# Altium schematic sheet SLO.SchDoc
size B; DrawnBy: PWS; Engineer: PWS; DocumentNumber: 6; Revision: 1; SheetNumber: 6; SheetTotal: 7
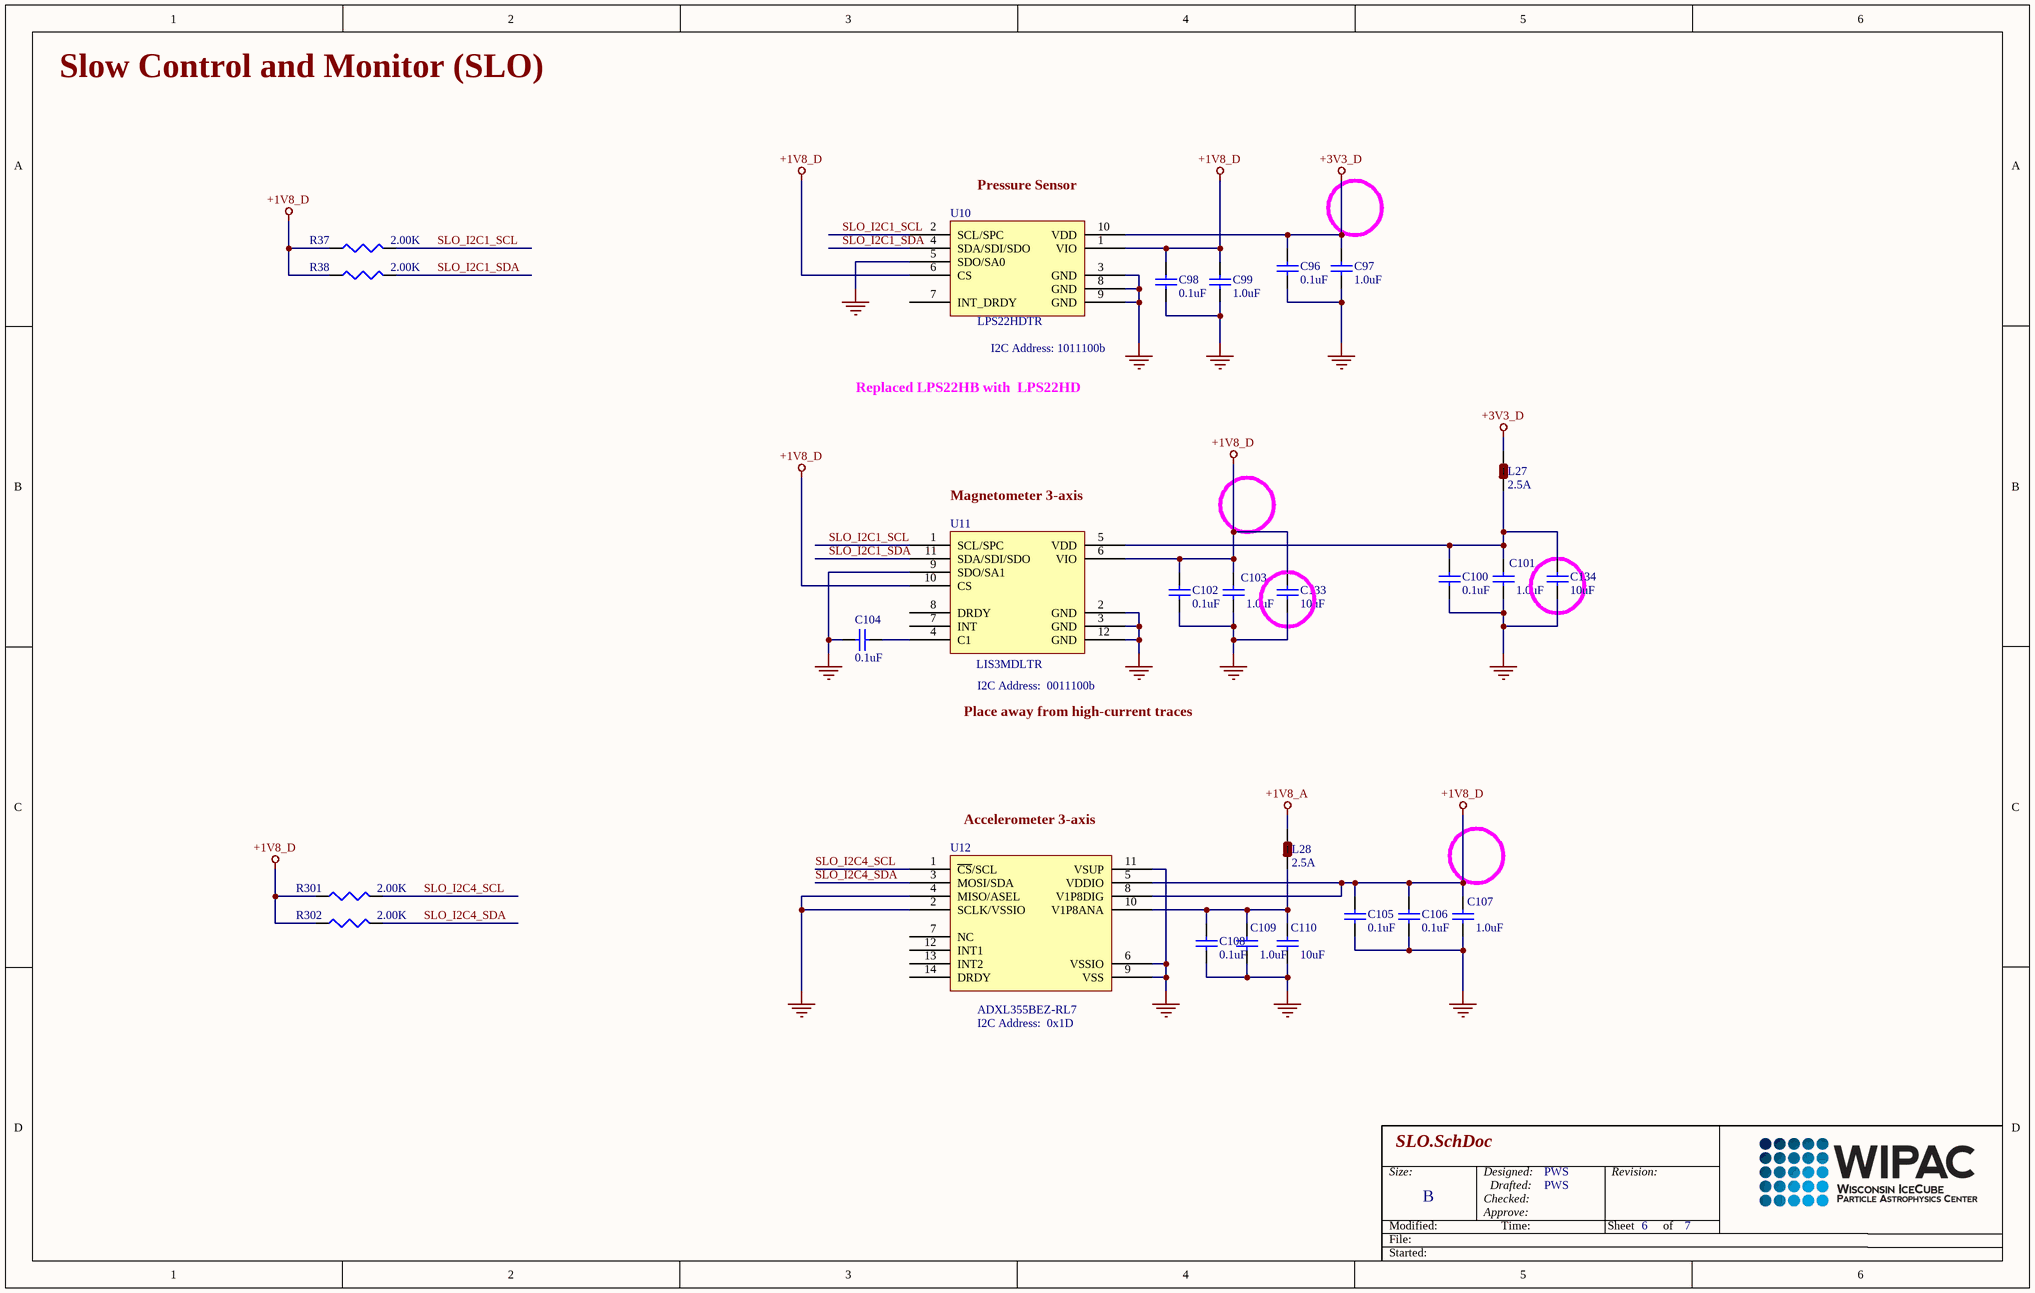
[diagram p0: SLO.SchDoc]

## Parts
C96  Capacitance: 0.1uF  [CAPC_0603]  (hidden comment: 0.1uF_603_50V)
C97  Capacitance: 1.0uF  [CAPC_0603]  (hidden comment: 1.0uF_603_25V)
C98  Capacitance: 0.1uF  [CAPC_0603]  (hidden comment: 0.1uF_603_50V)
C99  Capacitance: 1.0uF  [CAPC_0603]  (hidden comment: 1.0uF_603_25V)
C100  Capacitance: 0.1uF  [CAPC_0603]  (hidden comment: 0.1uF_603_50V)
C101  Capacitance: 1.0uF  [CAPC_0603]  (hidden comment: 1.0uF_603_25V)
C102  Capacitance: 0.1uF  [CAPC_0603]  (hidden comment: 0.1uF_603_50V)
C103  Capacitance: 1.0uF  [CAPC_0603]  (hidden comment: 1.0uF_603_25V)
C104  Capacitance: 0.1uF  [CAPC_0603]  (hidden comment: 0.1uF_603_50V)
C105  Capacitance: 0.1uF  [CAPC_0603]  (hidden comment: 0.1uF_603_50V)
C106  Capacitance: 0.1uF  [CAPC_0603]  (hidden comment: 0.1uF_603_50V)
C107  Capacitance: 1.0uF  [CAPC_0603]  (hidden comment: 1.0uF_603_25V)
C108  Capacitance: 0.1uF  [CAPC_0603]  (hidden comment: 0.1uF_603_50V)
C109  Capacitance: 1.0uF  [CAPC_0603]  (hidden comment: 1.0uF_603_25V)
C110  Capacitance: 10uF  [CAPC_0805]  (hidden comment: 10uF_805_10V)
C133  Capacitance: 10uF  [CAPC_0805]  (hidden comment: 10uF_805_10V)
C134  Capacitance: 10uF  [CAPC_0805]  (hidden comment: 10uF_805_10V)
L27  Max Current Rating: 2.5A  [SMD-0805]  (hidden comment: 2.5A_Bead_0805)
L28  Max Current Rating: 2.5A  [SMD-0805]  (hidden comment: 2.5A_Bead_0805)
R37  Resistance: 2.00K  [RES_0603]  (hidden comment: R_2.00K_603_1%)
R38  Resistance: 2.00K  [RES_0603]  (hidden comment: R_2.00K_603_1%)
R301  Resistance: 2.00K  [RES_0603]  (hidden comment: R_2.00K_603_1%)
R302  Resistance: 2.00K  [RES_0603]  (hidden comment: R_2.00K_603_1%)
U10  LPS22HDTR  [HLGA-10L]
U11  LIS3MDLTR  [VFLGA-12]
U12  ADXL355BEZ-RL7  [E-14-1]

## Nets
+1V8_A: L28.2
+1V8_D: C98.2 C99.2 C102.2 C103.2 C105.2 C106.2 C107.2 C133.2 R37.1 R38.1 R301.1 R302.1 U10.1(VIO) U10.6(CS) U11.6(VIO) U11.10(CS) U12.5(VDDIO) U12.8(V1P8DIG)
+3V3_D: C96.2 C97.2 L27.2 U10.10(VDD)
GND: C96.1 C97.1 C98.1 C99.1 C100.1 C101.1 C102.1 C103.1 C104.2 C105.1 C106.1 C107.1 C108.1 C109.1 C110.1 C133.1 C134.1 U10.3(GND) U10.5(SDO/SA0) U10.8(GND) U10.9(GND) U11.2(GND) U11.3(GND) U11.9(SDO/SA1) U11.12(GND) U12.2(SCLK/VSSIO) U12.4(MISO/ASEL) U12.6(VSSIO) U12.9(VSS) U12.11(VSUP)
SLO_I2C1_SCL: R37.2 U10.2(SCL/SPC) U11.1(SCL/SPC)
SLO_I2C1_SDA: R38.2 U10.4(SDA/SDI/SDO) U11.11(SDA/SDI/SDO)
SLO_I2C4_SCL: R301.2 U12.1(~{CS}/SCL)
SLO_I2C4_SDA: R302.2 U12.3(MOSI/SDA)
NetC100_2: C100.2 C101.2 C134.2 L27.1 U11.5(VDD)
NetC104_1: C104.1 U11.4(C1)
NetC108_2: C108.2 C109.2 C110.2 L28.1 U12.10(V1P8ANA)

Not connected (* = marked no-connect by the designer): U10 7(INT_DRDY); U11 7(INT) 8(DRDY); U12 7(NC) 12(INT1) 13(INT2) 14(DRDY)

## Notes on the sheet
- Slow Control and Monitor (SLO)
- (near U10) Pressure Sensor
- (near U10) I2C Address: 1011100b
- Replaced LPS22HB with  LPS22HD
- (near U11) Magnetometer 3-axis
- (near U11) I2C Address:  0011100b
- Place away from high-current traces
- (near U12) Accelerometer 3-axis
- (near U12) I2C Address:  0x1D
- Size:
- Designed:
- Revision:
- Modified:
- File:
- B
- Checked:
- Approve:
- Drafted:
- Time:
- Sheet
- of
- Started:

## Library data of the parts
C96 C98 C100 C102 C104-C106 C108 = CapC_0.1uF_603_50V: 0.1µF ±10% 50V Ceramic Capacitor X7R 0603 (1608 Metric); Manufacturer: TDK; Manufacturer Part Number: CGJ3E2X7R1H104K080AA; Ratings: COTS; ComponentLink1Description: Datasheet; ComponentLink1URL: https://product.tdk.com/info/en/catalog/datasheets/mlcc_highreliability_general_en.pdf; ComponentLink2Description: Supplier Link; ComponentLink2URL: https://www.digikey.com/products/en?keywords=445-8122-1-ND; Supplier 1: Digi-Key; Stock 1: 697211; Pricing 1: 1 = 0.22000, 10 = 0.15300, 100 = 0.07740, 500 = 0.05294, 1000 = 0.04683 (USD); RoHS: Yes; Mount: Surface Mount; Case/Package: 0603; Weight: 7.1E-05oz; Case Code (Imperial): 0603; Case Code (Metric): 1608; Min Operating Temperature: -55°C; Max Operating Temperature: 125°C; Tolerance: 10%; Voltage Rating: 50V; Voltage Rating (DC): 50V; Packaging: Tape and Reel; Package Quantity: 1; Dielectric: X7R; Termination: SMD/SMT; Composition: Ceramic; Length: 1.6mm; Height: 0.8mm; Width: 0.8mm; Thickness: 0.035inch; Depth: 0.8mm; Radiation Hardening: No; Lead Free: Lead Free; Supplier Part Number 1: 445-8122-1-ND
C97 C99 C101 C103 C107 C109 = CapC_1.0uF_603_25V: 1µF ±10% 25V Ceramic Capacitor X7R 0603 (1608 Metric); Manufacturer: Murata; Manufacturer Part Number: GCJ188R71E105KA01D; Supplier 1: Digi-Key; Supplier Part Number 1: 490-14409-1-ND; RoHS: No; ComponentLink1URL: https://www.digikey.com/products/en?keywords=490-14409-1-ND; ComponentLink1Description: Supplier Link; Stock 1: 166271; Pricing 1: 1=0.28000, 10=0.19400, 100=0.11020, 500=0.07780, 1000=0.06807 (USD); Case/Package: 0603; Lead Free: Lead Free; ComponentLink2Description: Datasheet; ComponentLink2URL: https://search.murata.co.jp/Ceramy/image/img/A01X/G101/ENG/GCJ188R71E105KA01-01.pdf; ComponentLink3Description: Catalog; ComponentLink3URL: https://www.murata.com/~/media/webrenewal/support/library/catalog/products/capacitor/mlcc/c03e.ashx?la=en-us
C110 C133 C134 = CapC_10uF_805_10V: Capacitor; Manufacturer: Murata; Manufacturer Part Number: GCJ21BR71A106KE01L; Tolerance: 10%; Dielectric: X7R; Voltage Rating: 10V; ComponentLink1URL: https://www.murata.com/~/media/webrenewal/support/library/catalog/products/capacitor/mlcc/c03e.ashx?la=en-us; ComponentLink1Description: Datasheet; Supplier 1: Digi-Key; Stock 1: 140399; Pricing 1: 1 = 0.70000, 10 = 0.49300, 100 = 0.32440, 500 = 0.24032, 1000 = 0.20428 (USD); RoHS: Yes; ComponentLink2URL: https://www.digikey.com/products/en?keywords=490-12646-1-ND; ComponentLink2Description: Supplier Link; Supplier Part Number 1: 490-12646-1-ND; Mount: Surface Mount; Case/Package: 0805; Weight: 0.000335oz; Case Code (Metric): 2012; Case Code (Imperial): 0805; Min Operating Temperature: -55°C; Max Operating Temperature: 125°C; Packaging: Tape and Reel; Termination: SMD/SMT; Voltage Rating (DC): 10V; Package Quantity: 3000; Features: Soft Termination; Length: 2mm; Height: 1.25mm; Width: 0.049inch; Thickness: 0.057inch; Depth: 1.25mm; Ratings: AEC-Q200
L27 L28 = Bead SM_805_2.5A_TDK: MPZ2012S331ATD25; Manufacturer: TDK; DC Resistance (DCR): 50mR; Number of Lines: 1; Impedance: 330R; Tolerance: 25%; Test Frequency: 100MHz; Supplier 1: Digi-Key; Manufacturer Part Number: MPZ2012S331ATD25; RoHS: Yes; Stock 1: 19319; Pricing 1: 1=0.13000, 10=0.10400, 25=0.08080, 50=0.06700, 100=0.05780, 250=0.04620, 500=0.04158, 1000=0.03465 (USD); Packaging: Tape and Reel; ComponentLink1URL: https://product.tdk.com/info/en/catalog/datasheets/beads_automotive_power_mpz2012_en.pdf; ComponentLink1Description: Datasheet; Supplier Part Number 1: 445-172907-1-ND; Mount: Surface Mount; Case/Package: 0805; Weight: 0.000194oz; Case Code (Metric): 2012; Case Code (Imperial): 0805; Min Operating Temperature: -55°C; Max Operating Temperature: 125°C; Package Quantity: 4000; Termination: SMD/SMT; Max DC Current: 2.5A; Length: 0.079inch; Height: 0.041inch; Width: 0.049inch; Ratings: AEC-Q200; Lead Free: Lead Free
R37 R38 R301 R302 = R_2.00K_603_1%: RES 2.00K OHM 1/10W 1% 0603 SMD; Manufacturer: Panasonic; Manufacturer Part Number: ERJ3EKF2001V; Temperature Coefficient: 100ppm/°C; Max Power Dissipation: 100mW; Voltage Rating: 75V; Voltage Rating (DC): 50V; Supplier 1: Digi-Key; RoHS: Yes; Stock 1: 3931284; Pricing 1: 1 = 0.10000, 10 = 0.06500, 100 = 0.02640, 1000 = 0.01186, 2500 = 0.01029 (USD); Packaging: Tape and Reel; Tolerance: 1%; Composition: Thick Film; Features: Automotive AEC-Q200; Height: 0.022inch; Number of Terminations: 2; ComponentLink1URL: https://datasheet.ciiva.com/16200/aoa0000ce2-16200501.pdf?src-supplier=Future+Electronics; ComponentLink1Description: https://datasheet.ciiva.com/16200/aoa0000ce2-16200501.pdf?src-supplier=Future+Electronics; Supplier Part Number 1: P2.00KHCT-ND; Mount: Surface Mount; Case/Package: 0603; Contact Plating: Tin; Case Code (Metric): 1608; Case Code (Imperial): 0603; Min Operating Temperature: -55°C; Max Operating Temperature: 155°C; Package Quantity: 1; Power Rating: 100mW; Military Standard: Not; Termination: SMD/SMT; Length: 1.6mm; Width: 0.031inch; Depth: 0.8mm; Radiation Hardening: No; REACH SVHC: No SVHC; Lead Free: Lead Free; ComponentLink2URL: https://datasheet.ciiva.com/43460/1678782-43460485.pdf?src-supplier=Farnell; ComponentLink2Description: https://datasheet.ciiva.com/43460/1678782-43460485.pdf?src-supplier=Farnell; ComponentLink3URL: https://datasheet.ciiva.com/28673/1678782-28673990.pdf?src-supplier=Element14; ComponentLink3Description: https://datasheet.ciiva.com/28673/1678782-28673990.pdf?src-supplier=Element14; ComponentLink4URL: https://datasheet.ciiva.com/46377/1678782-46377366.pdf?src-supplier=Element14; ComponentLink4Description: https://datasheet.ciiva.com/46377/1678782-46377366.pdf?src-supplier=Element14; ComponentLink5URL: https://datasheet.ciiva.com/30064/aoa0000ce2-30064920.pdf?src-supplier=Onlinecomponents.com; ComponentLink5Description: https://datasheet.ciiva.com/30064/aoa0000ce2-30064920.pdf?src-supplier=Onlinecomponents.com; ComponentLink6URL: https://datasheet.ciiva.com/16771/70260748-16771369.pdf?src-supplier=Allied+Electronics; ComponentLink6Description: https://datasheet.ciiva.com/16771/70260748-16771369.pdf?src-supplier=Allied+Electronics; ComponentLink7URL: https://datasheet.ciiva.com/17214/aoa0000ce2-17214393.pdf?src-supplier=Avnet+Europe; ComponentLink7Description: https://datasheet.ciiva.com/17214/aoa0000ce2-17214393.pdf?src-supplier=Avnet+Europe; ComponentLink8URL: https://datasheet.ciiva.com/6082/1678782-6082059.pdf?src-supplier=Farnell; ComponentLink8Description: https://datasheet.ciiva.com/6082/1678782-6082059.pdf?src-supplier=Farnell; ComponentLink9URL: https://datasheet.ciiva.com/24027/aoa0000ce2-24027453.pdf?src-supplier=Mouser; ComponentLink9Description: https://datasheet.ciiva.com/24027/aoa0000ce2-24027453.pdf?src-supplier=Mouser
U10 = LPS22HDTR: Pressure Sensor  Absolute   10-VFLGA; Manufacturer: STMicroelectronics; Supplier 1: Digi-Key; Manufacturer Part Number: LPS22HDTR; Stock 1: 178; Pricing 1: 1 = 4.23000, 10 = 3.79600, 25 = 3.58880, 100 = 3.11030, 500 = 2.64770, 1000 = 2.23300 (USD); RoHS: No; ComponentLink2URL: https://www.digikey.com/products/en?keywords=497-17587-1-ND; ComponentLink2Description: Supplier Link; Supplier Part Number 1: 497-17587-1-ND; ComponentLink1Description: Datasheet; ComponentLink1URL: https://www.st.com/content/ccc/resource/technical/document/datasheet/group3/8a/d9/56/bc/42/4c/42/ae/DM00342209/files/DM00342209.pdf/jcr:content/translations/en.DM00342209.pdf; ComponentLink3URL: http://www.st.com/content/ccc/resource/technical/document/datasheet/group3/8a/d9/56/bc/42/4c/42/ae/DM00342209/files/DM00342209.pdf/jcr:content/translations/en.DM00342209.pdf?src-supplier=Digi-Key; ComponentLink3Description: http://www.st.com/content/ccc/resource/technical/document/datasheet/group3/8a/d9/56/bc/42/4c/42/ae/DM00342209/files/DM00342209.pdf/jcr:content/translations/en.DM00342209.pdf?src-supplier=Digi-Key
U11 = LIS3MDLTR: Magnetoresistive Sensor X, Y, Z Axis 12-LGA (2x2); Manufacturer: STMicroelectronics; Max Supply Voltage: 3.6V; Min Supply Voltage: 1.9V; Max Supply Current: 270uA; Resolution: 16b; Output Type: SPI; Axis: X, Y, Z; ComponentLink1Description: Datasheet; ComponentLink1URL: https://www.st.com/content/ccc/resource/technical/document/datasheet/54/2a/85/76/e3/97/42/18/DM00075867.pdf/files/DM00075867.pdf/jcr:content/translations/en.DM00075867.pdf; Supplier 1: Digi-Key; Manufacturer Part Number: LIS3MDLTR; Stock 1: 20171; Pricing 1: 1 = 1.67000, 10 = 1.49800, 100 = 1.20450, 500 = 0.98958, 1000 = 0.81993 (USD); RoHS: Yes; Mount: Surface Mount; Case/Package: LGA; Number of Pins: 12; Contact Plating: Gold; Min Operating Temperature: -40°C; Max Operating Temperature: 85°C; Packaging: Tape and Reel; Package Quantity: 8000; Sensing Method: Magnetoresistive; Radiation Hardening: No; REACH SVHC: No SVHC; Lead Free: Lead Free; Supplier Part Number 1: 497-13892-1-ND; ComponentLink2Description: Footprint data; ComponentLink2URL: http://mydiscuz.b0.upaiyun.com/forum/201602/17/145811me52roaer17ott71.attach?_upd=LSM303AGR_Footprint.pdf
U12 = ADXL355BEZ-RL7: Accelerometer X, Y, Z Axis ±2g, 4g, 8g 1.5kHz 14-CLCC (6x6); Manufacturer: Analog Devices; ComponentLink1Description: Datasheet; ComponentLink1URL: https://www.analog.com/media/en/technical-documentation/data-sheets/ADXL354_355.pdf; Supplier 1: Digi-Key; Manufacturer Part Number: ADXL355BEZ-RL7; Stock 1: 1191; Pricing 1: 1 = 53.40000, 10 = 50.16300, 100 = 44.98520 (USD); RoHS: No; Number of Pins: 14; Lead Free: Contains Lead; ComponentLink2URL: https://www.analog.com/media/en/technical-documentation/data-sheets/ADXL354_355.pdf?src-supplier=Digi-Key; ComponentLink2Description: https://www.analog.com/media/en/technical-documentation/data-sheets/ADXL354_355.pdf?src-supplier=Digi-Key; Supplier Part Number 1: ADXL355BEZ-RL7CT-ND